# Altium schematic sheet 3-VW_MODULE.SchDoc: RD15002_SingleSCT.PrjPcb
size A4; DrawnBy: 邓勇杰; Revision: A1.0.0; SheetNumber: 4; SheetTotal: 10; Time: 2015/12/2
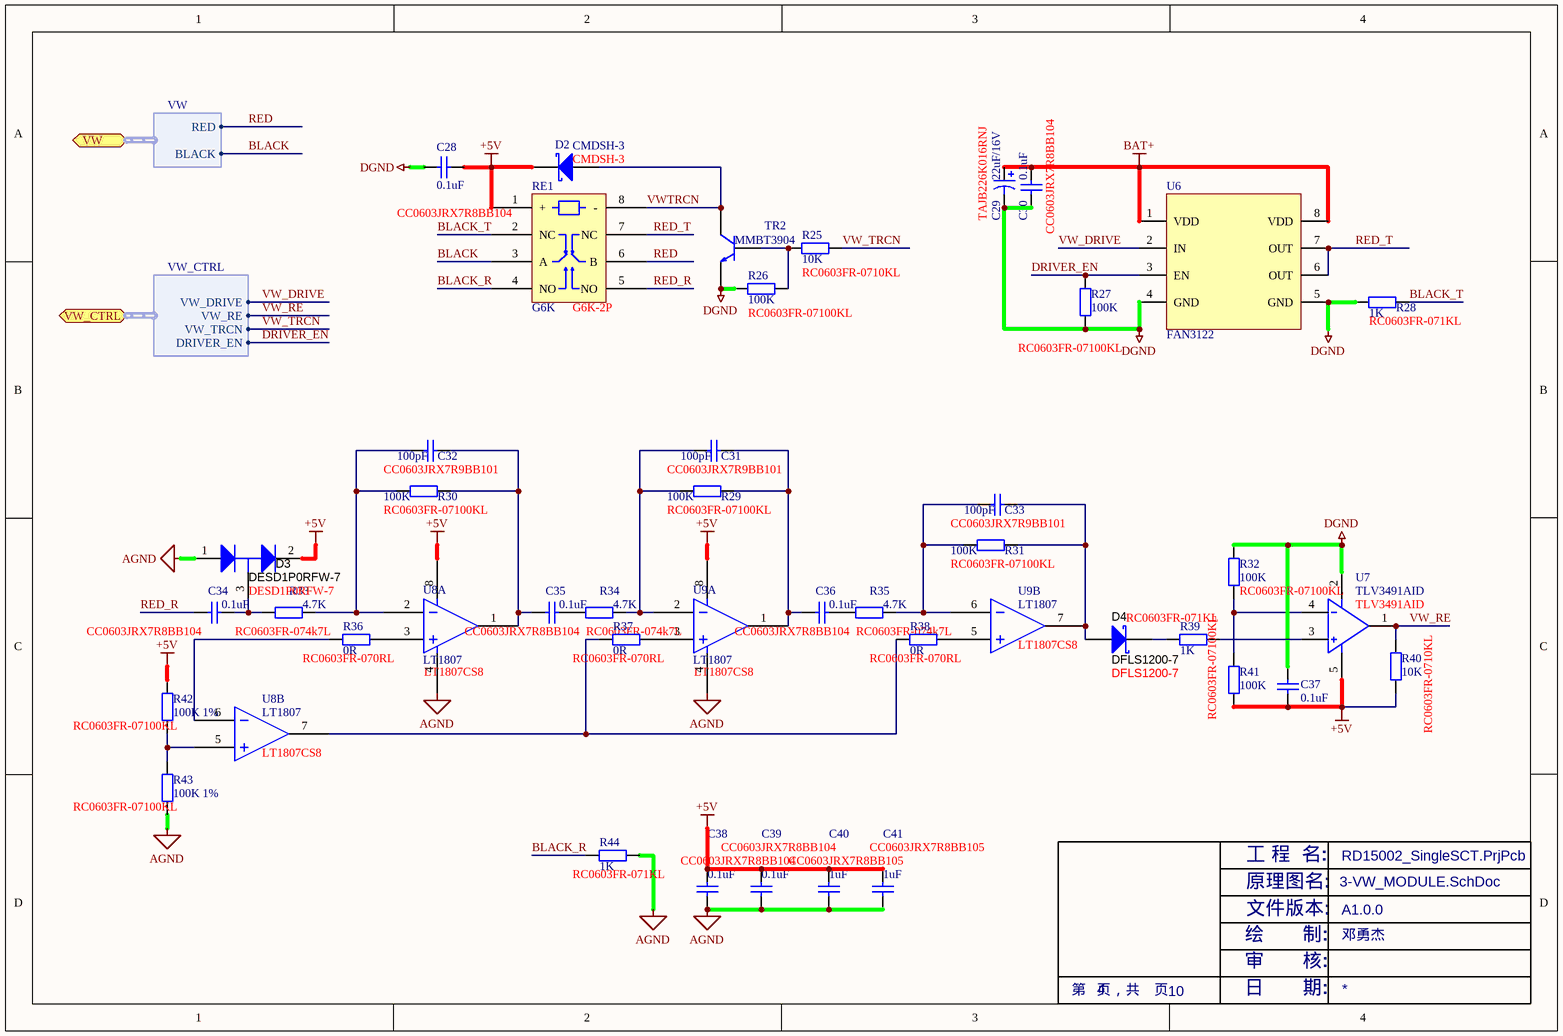
[diagram p0: 3-VW_MODULE.SchDoc]

## Parts
C28  0.1uF  Type No.: CC0603JRX7R8BB104  [CC0603]
C29  22uF/16V  Part No.: TAJB226K016RNJ  [CB3528]
C30  0.1uF  Type No.: CC0603JRX7R8BB104  [CC0603]
C31  100pF  Type No.: CC0603JRX7R9BB101  [CC0603]
C32  100pF  Type No.: CC0603JRX7R9BB101  [CC0603]
C33  100pF  Type No.: CC0603JRX7R9BB101  [CC0603]
C34  0.1uF  Type No.: CC0603JRX7R8BB104  [CC0603]
C35  0.1uF  Type No.: CC0603JRX7R8BB104  [CC0603]
C36  0.1uF  Type No.: CC0603JRX7R8BB104  [CC0603]
C37  0.1uF  [CC0603]
C38  0.1uF  Type No.: CC0603JRX7R8BB104  [CC0603]
C39  0.1uF  Type No.: CC0603JRX7R8BB104  [CC0603]
C40  1uF  Type No.: CC0603JRX7R8BB105  [CC0603]
C41  1uF  Type No.: CC0603JRX7R8BB105  [CC0603]
D2  CMDSH-3  [SOD323]
D3  DESD1P0RFW-7  [SOT-323]
D4  DFLS1200-7  [powerDI123]
R25  10K  Type No.: RC0603FR-0710KL  [CC0603]
R26  100K  Type No.: RC0603FR-07100KL  [CC0603]
R27  100K  Type No.: RC0603FR-07100KL  [CC0603]
R28  1K  Type No.: RC0603FR-071KL  [CC0603]
R29  100K  Type No.: RC0603FR-07100KL  [CC0603]
R30  100K  Type No.: RC0603FR-07100KL  [CC0603]
R31  100K  Type No.: RC0603FR-07100KL  [CC0603]
R32  100K  Type No.: RC0603FR-07100KL  [CC0603]
R33  4.7K  Type No.: RC0603FR-074k7L  [CC0603]
R34  4.7K  Type No.: RC0603FR-074k7L  [CC0603]
R35  4.7K  Type No.: RC0603FR-074k7L  [CC0603]
R36  0R  Type No.: RC0603FR-070RL  [CC0603]
R37  0R  Type No.: RC0603FR-070RL  [CC0603]
R38  0R  Type No.: RC0603FR-070RL  [CC0603]
R39  1K  Type No.: RC0603FR-071KL  [CC0603]
R40  10K  Type No.: RC0603FR-0710KL  [CC0603]
R41  100K  Type No.: RC0603FR-07100KL  [CC0603]
R42  100K 1%  Type No.: RC0603FR-07100KL  [CC0603]
R43  100K 1%  Type No.: RC0603FR-07100KL  [CC0603]
R44  1K  Type No.: RC0603FR-071KL  [CC0603]
RE1  G6K  Type No.: G6K-2P  [G6K]
TR2  MMBT3904  [SOT-23W]
U6  FAN3122  [SO-8]
U7  TLV3491AID  [SOT-23-5]
U8  LT1807  Type No.: LT1807CS8  [SO-8]  (parts A,B of 2)
U9  LT1807  Type No.: LT1807CS8  [SO-8]  (parts A,B of 2)

## Ports
VW (harness VW), VW_CTRL (harness VW_CTRL)

## Harnesses
VW_CTRL: VW_RE, VW_DRIVE, VW_TRCN, DRIVER_EN
VW: RED, BLACK

## Nets
+5V: C28.1 C37.2 C38.2 C39.2 C40.2 C41.2 D2.2(K) D3.2(K) R40.1 R41.1 R42.1 RE1.1(+) U7.5(+VS) U8.8 U9.8
AGND: C38.1 C39.1 C40.1 C41.1 D3.1(A) R43.2 R44.2 U8.4 U9.4
BAT+: C29.1 C30.2 U6.1(VDD) U6.8(VDD)
DGND: C28.2 C29.2 C30.1 C37.1 R26.1 R27.2 R28.2 R32.2 TR2.2 U6.4(GND) U6.5(GND) U7.2(-VS)
BLACK: RE1.3(A) ; port VW.BLACK
BLACK_R: R44.1 RE1.4(NO)
BLACK_T: R28.1 RE1.2(NC)
DRIVER_EN: R27.1 U6.3(EN) ; port VW_CTRL.DRIVER_EN
RED: RE1.6(B) ; port VW.RED
RED_R: C34.2 RE1.5(NO)
RED_T: RE1.7(NC) U6.6(OUT) U6.7(OUT)
VW_DRIVE: U6.2(IN) ; port VW_CTRL.VW_DRIVE
VW_RE: R40.2 U7.1(OUT) ; port VW_CTRL.VW_RE
VW_TRCN: R25.2 ; port VW_CTRL.VW_TRCN
VWTRCN: D2.1(A) RE1.8(-) TR2.3
NetC31_1: C31.1 C36.2 R29.1 U9.1
NetC31_2: C31.2 R29.2 R34.1 U9.2
NetC32_1: C32.1 C35.2 R30.1 U8.1
NetC32_2: C32.2 R30.2 R33.1 U8.2
NetC33_1: C33.1 D4.2(A) R31.1 U9.7
NetC33_2: C33.2 R31.2 R35.1 U9.6
NetC34_1: C34.1 D3.3(C) R33.2
NetC35_1: C35.1 R34.2
NetC36_1: C36.1 R35.2
NetD4_1: D4.1(K) R39.2
NetR25_1: R25.1 R26.2 TR2.1
NetR32_1: R32.1 R41.2 U7.4(-)
NetR36_1: R36.1 U8.3
NetR36_2: R36.2 U8.6
NetR37_1: R37.1 U9.3
NetR37_2: R37.2 R38.2 U8.7
NetR38_1: R38.1 U9.5
NetR39_1: R39.1 U7.3(+)
NetR42_2: R42.2 R43.1 U8.5

## Notes on the sheet
- 文件版本:
- 原理图名:
- 工 程  名:
- 绘       制:
- 审       核:
- 第   页，共    页
- 日       期:

## Library data of the parts
C28 C30-C41 = Cap: Capacitor
  C37: Published: 8-Jun-2000; LatestRevisionDate: 17-Jul-2002; LatestRevisionNote: Re-released for DXP Platform.; PackageReference: RAD-0.3; Publisher: Altium Limited; Value: 0.1uF
C29 = Cap Pol1: Polarized Capacitor (Radial)
D2 = D Schottky: Schottky Diode; Type No.: CMDSH-3
D3 = BAV99WT1G: TVS DIODE,70VVVM,8VC,SOT-323; Type No.: DESD1P0RFW-7
D4 = DFLS1200-7: Diode, Schotky, 200V, 1A, PowerDI123; Part No.: DFLS1200-7
R25-R44 = Res2: Resistor
TR2 = NPN
U8 U9 = LM833N
U7 = TLV3491AID: Type No.: TLV3491AID